# Altium schematic sheet tp4056.SchDoc
size A4; SheetNumber: 2; SheetTotal: 5
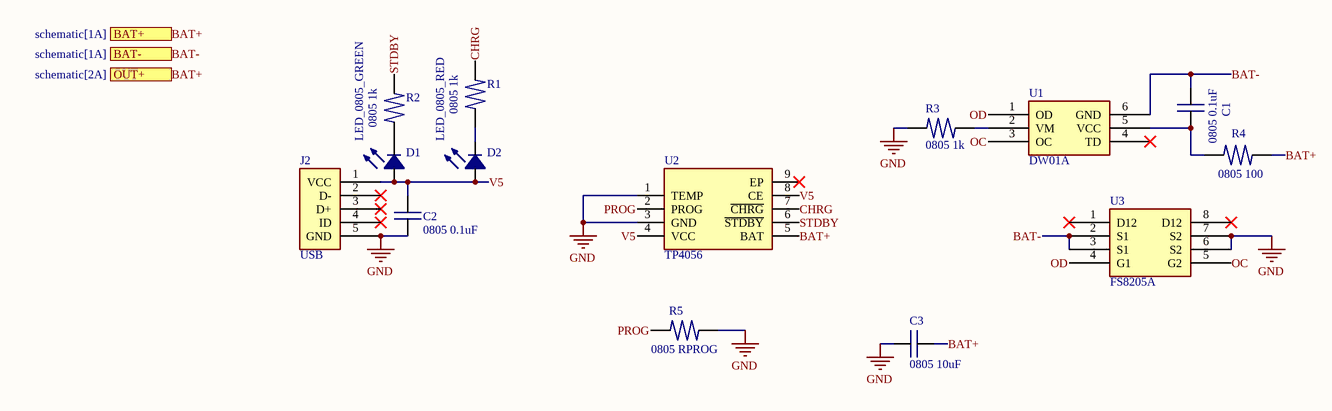
[diagram p0: tp4056.SchDoc]

## Parts
C1  0805 0.1uF  [CAPACITOR 0805]
C2  0805 0.1uF  [CAPACITOR 0805]
C3  0805 10uF  [CAPACITOR 0805]
D1  LED_0805_GREEN  [LED_0805_GREEN]
D2  LED_0805_RED  [LED_0805_RED]
J2  USB  [USB]
R1  0805 1k  [RESISTOR_0805]
R2  0805 1k  [RESISTOR_0805]
R3  0805 1k  [RESISTOR_0805]
R4  0805 100  [RESISTOR_0805]
R5  0805 RPROG  [RESISTOR_0805]
U1  DW01A  [DW01A]
U2  TP4056  [TP4056]
U3  FS8205A  [FS8205A]

## Ports
BAT+ (see schematic[1A]), BAT- (see schematic[1A]), OUT+ (see schematic[2A])

## Nets
GND: C2.1 C3.1 J2.5(GND) R3.2 R5.2 U2.1(TEMP) U2.3(GND) U3.6(S2) U3.7(S2)
BAT+: C3.2 R4.2 U2.5(BAT) ; port BAT+, port OUT+
BAT-: C1.2 U1.6(GND) U3.2(S1) U3.3(S1) ; port BAT-
CHRG: R1.2 U2.7(~{CHRG})
OC: U1.3(OC) U3.5(G2)
OD: U1.1(OD) U3.4(G1)
PROG: R5.1 U2.2(PROG)
STDBY: R2.2 U2.6(~{STDBY})
V5: C2.2 D1.1 D2.1 J2.1(VCC) U2.4(VCC) U2.8(CE)
NetC1_1: C1.1 R4.1 U1.5(VCC)
NetD1_2: D1.2 R2.1
NetD2_2: D2.2 R1.1
NetR3_1: R3.1 U1.2(VM)

Not connected (* = marked no-connect by the designer): J2 2(D-)* 3(D+)* 4(ID)*; U1 4(TD)*; U2 9(EP)*; U3 1(D12)* 8(D12)*

## Library data of the parts
C1-C3 = CAPACITOR 0805
R1-R5 = RESISTOR_0805
U1 = DW01A: BATTERY PROTECTION IC
U2 = TP4056: CHIP BATTERY CHARGER
U3 = FS8205A: 20V DUAL N-CHANNEL MOSFET TSSOP-8; ComponentLink1Description: Datasheet; ComponentLink1URL: https://www.ic-fortune.com/upload/Download/FS8205A-DS-12_EN.pdf